# Altium schematic sheet FMC connector.SchDoc: Shuttler
size 420 x 297 mm; Author: G.Kasprowicz; CompanyName: WUT ISE; DrawnBy: G.Kasprowicz; Organization: WUT ISE; Address1: PW ISE; Address2: Nowowiejska 15/19 00-665 Warsaw; Address3: gkasprow@gmail.com; DocumentNumber: 7; SheetNumber: 7; SheetTotal: 10; ModifiedBy: -; CheckedDate: -; Title2: FMC HPC connector; DivGrp: WUT ISE; Designer: G.Kasprowicz; ModifiedDate: -; ProjectName: Sensor Box
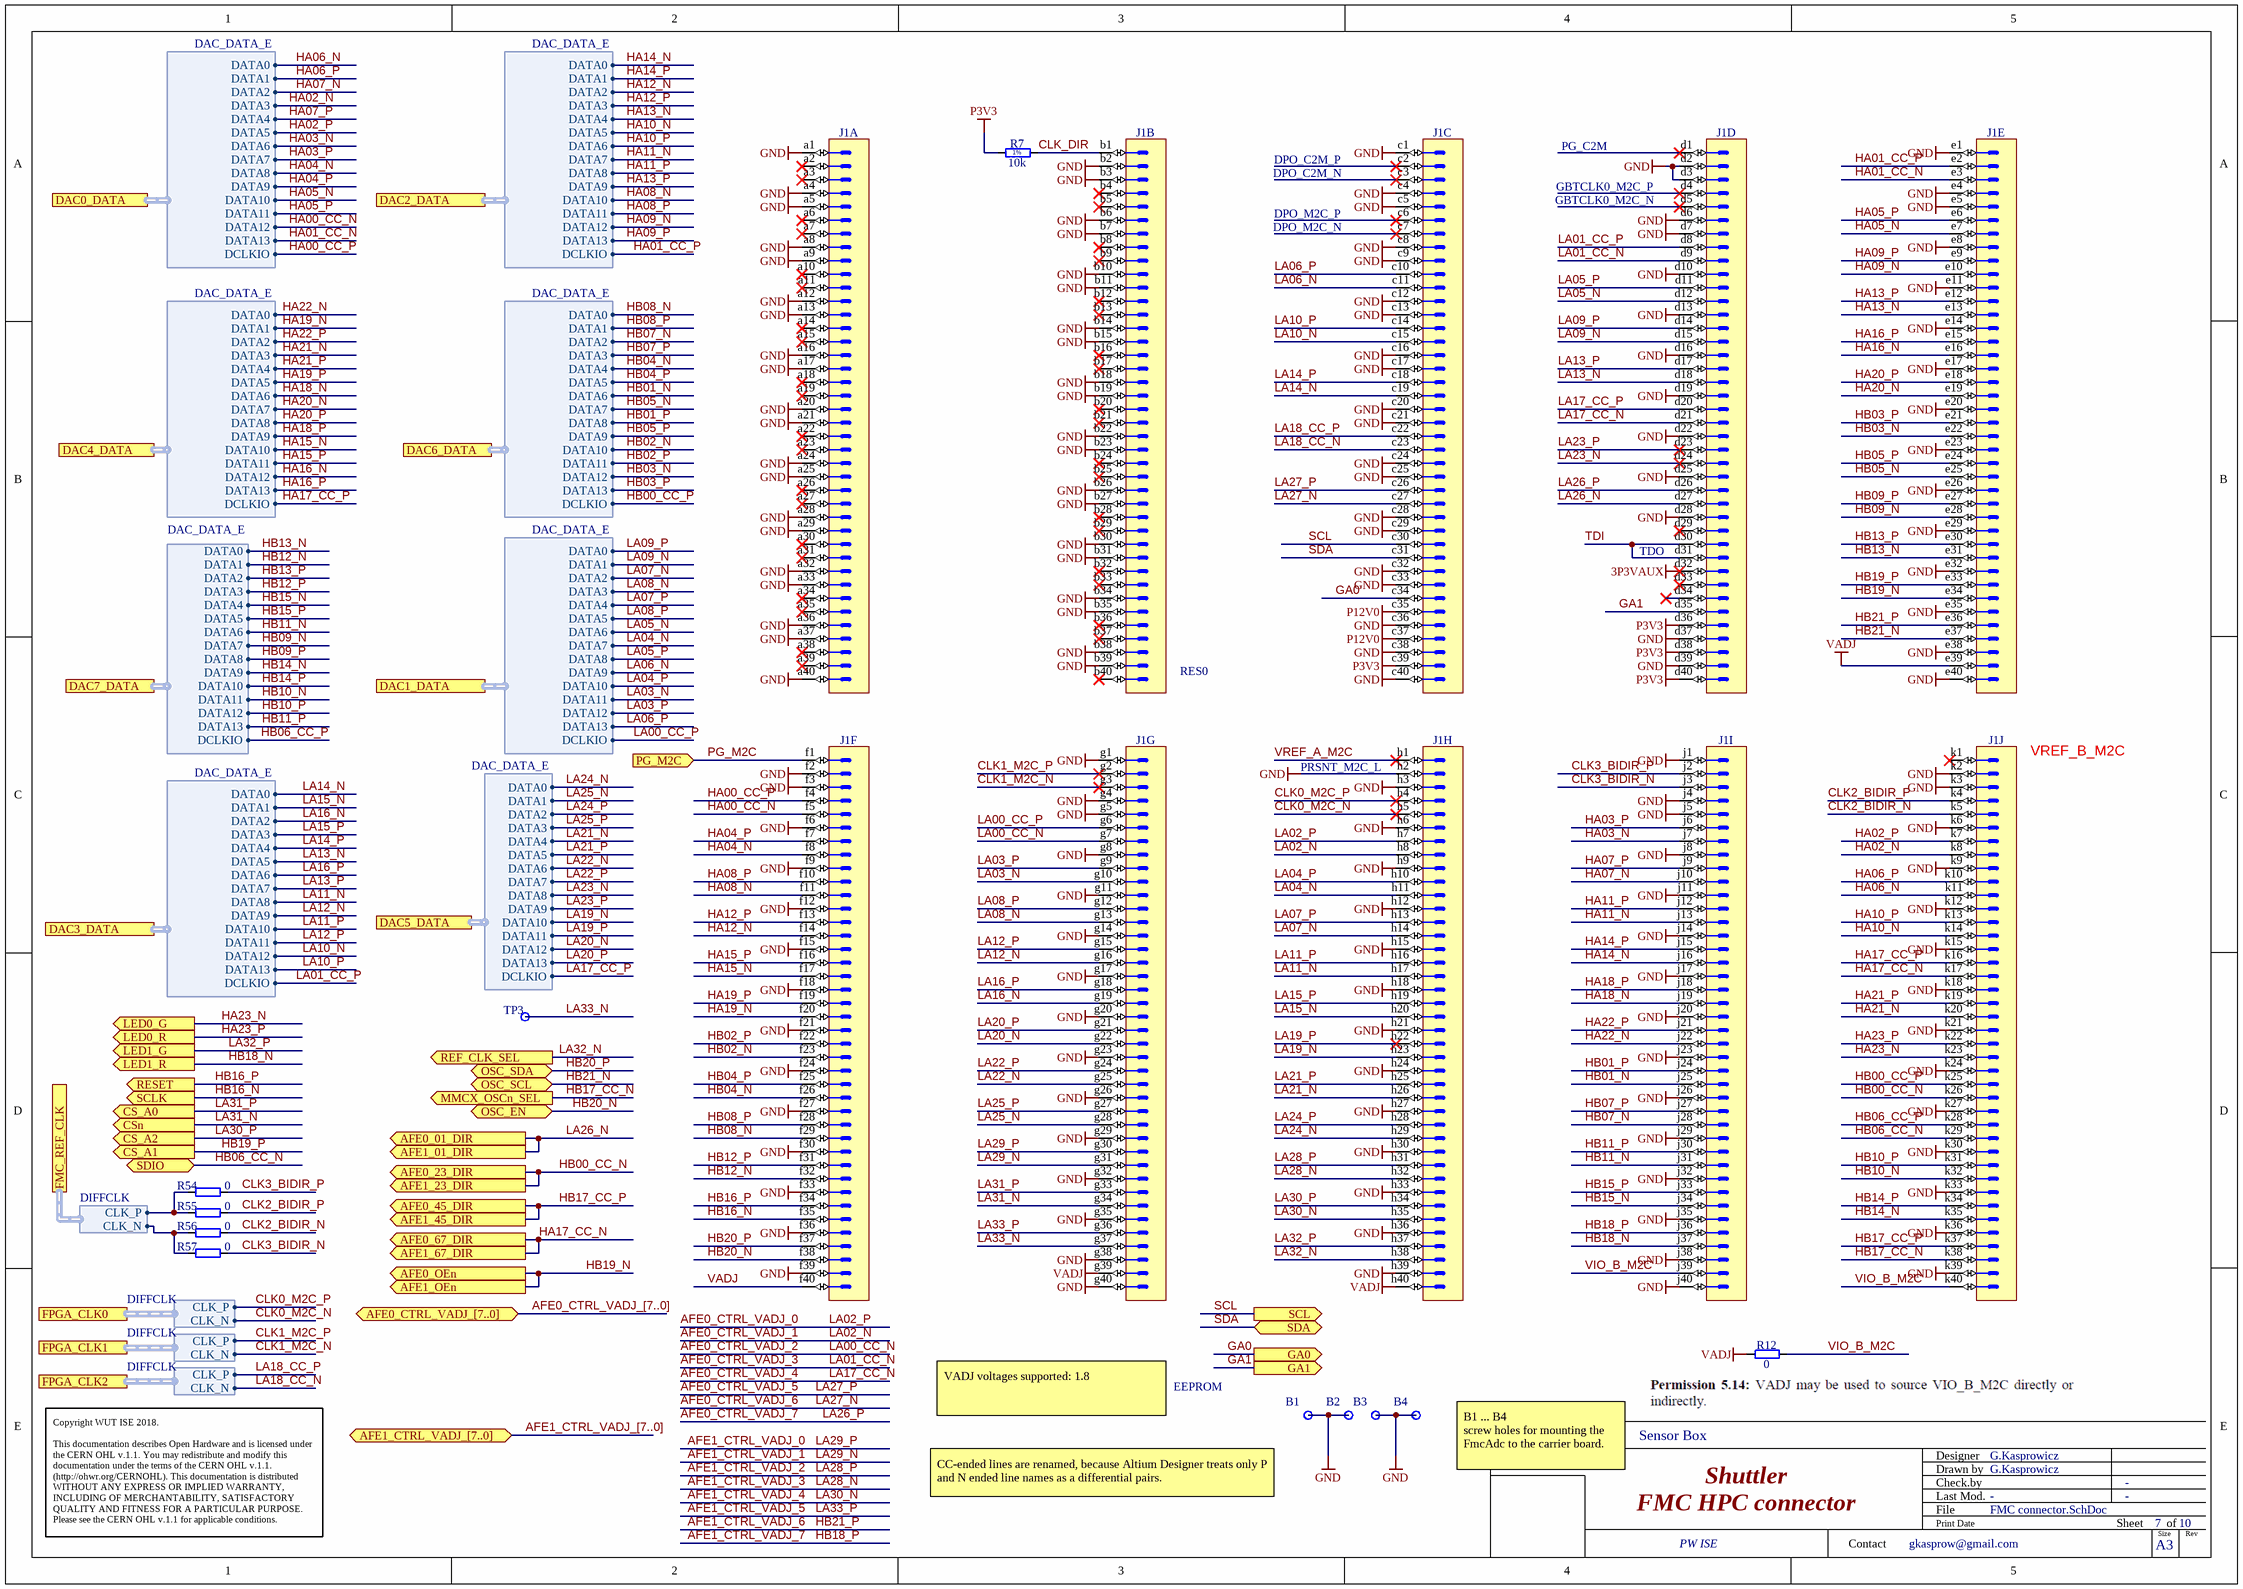
[diagram p0: FMC connector.SchDoc]

## Parts
B1  Plated Hole  [MTG300_600]  (value not drawn)
B2  Plated Hole  [MTG300_600]  (value not drawn)
B3  Plated Hole  [MTG300_600]  (value not drawn)
B4  Plated Hole  [MTG300_600]  (value not drawn)
J1  VITA 57  [SAMTEC_ASP-134488-01]  (value not drawn)  (parts A,B,C,D,E,F,G,H,I,J of 10)
R7  10k  [RESC1005X40N]
R12  0  [RESC1608X55N]
R54  0  [RESC1005X40N]
R55  0  [RESC1005X40N]
R56  0  [RESC1005X40N]
R57  0  [RESC1005X40N]
TP3  Test Point  [TPS127]  (value not drawn)  (no BOM)

## Ports
AFE0_01_DIR (out), AFE0_23_DIR (out), AFE0_45_DIR (out), AFE0_67_DIR (out), AFE0_CTRL_VADJ_[7..0] (bidir), AFE0_OEn (out), AFE1_01_DIR (out), AFE1_23_DIR (out), AFE1_45_DIR (out), AFE1_67_DIR (out), AFE1_CTRL_VADJ_[7..0] (bidir), AFE1_OEn (out), CS_A0 (out), CS_A1 (out), CS_A2 (out), CSn (out), DAC0_DATA (harness DAC_DATA_E), DAC1_DATA (harness DAC_DATA_E), DAC2_DATA (harness DAC_DATA_E), DAC3_DATA (harness DAC_DATA_E), DAC4_DATA (harness DAC_DATA_E), DAC5_DATA (harness DAC_DATA_E), DAC6_DATA (harness DAC_DATA_E), DAC7_DATA (harness DAC_DATA_E), FMC_REF_CLK (harness DIFFCLK), FPGA_CLK0 (harness DIFFCLK), FPGA_CLK1 (harness DIFFCLK), FPGA_CLK2 (harness DIFFCLK), GA0 (out), GA1 (out), LED0_G (out), LED0_R (out), LED1_G (out), LED1_R (out), MMCX_OSCn_SEL (out), OSC_EN (bidir), OSC_SCL (bidir), OSC_SDA (bidir), PG_M2C (in), REF_CLK_SEL (out), RESET (out), SCL (out), SCLK (out), SDA (bidir), SDIO (bidir)

## Harnesses
DAC_DATA_E: DATA0, DATA1, DATA2, DATA3, DATA4, DATA5, DATA6, DATA7, DATA8, DATA9, DATA10, DATA11, DATA12, DATA13, DCLKIO
DIFFCLK: CLK_P, CLK_N

## Nets
3P3VAUX: J1.d32
GND: B1.1 B2.1 B3.1 B4.1 J1.a1 J1.a4 J1.a5 J1.a8 J1.a9 J1.a12 J1.a13 J1.a16 J1.a17 J1.a20 J1.a21 J1.a24 J1.a25 J1.a28 J1.a29 J1.a32 J1.a33 J1.a36 J1.a37 J1.a40 J1.b2 J1.b3 J1.b6 J1.b7 J1.b10 J1.b11 J1.b14 J1.b15 J1.b18 J1.b19 J1.b22 J1.b23 J1.b26 J1.b27 J1.b30 J1.b31 J1.b34 J1.b35 J1.b38 J1.b39 J1.c1 J1.c4 J1.c5 J1.c8 J1.c9 J1.c12 J1.c13 J1.c16 J1.c17 J1.c20 J1.c21 J1.c24 J1.c25 J1.c28 J1.c29 J1.c32 J1.c33 J1.c36 J1.c38 J1.c40 J1.d2 J1.d3 J1.d6 J1.d7 J1.d10 J1.d13 J1.d16 J1.d19 J1.d22 J1.d25 J1.d28 J1.d37 J1.d39 J1.e1 J1.e4 J1.e5 J1.e8 J1.e11 J1.e14 J1.e17 J1.e20 J1.e23 J1.e26 J1.e29 J1.e32 J1.e35 J1.e38 J1.e40 J1.f2 J1.f3 J1.f6 J1.f9 J1.f12 J1.f15 J1.f18 J1.f21 J1.f24 J1.f27 J1.f30 J1.f33 J1.f36 J1.f39 J1.g1 J1.g4 J1.g5 J1.g8 J1.g11 J1.g14 J1.g17 J1.g20 J1.g23 J1.g26 J1.g29 J1.g32 J1.g35 J1.g38 J1.g40 J1.h2 J1.h3 J1.h6 J1.h9 J1.h12 J1.h15 J1.h18 J1.h21 J1.h24 J1.h27 J1.h30 J1.h33 J1.h36 J1.h39 J1.j1 J1.j4 J1.j5 J1.j8 J1.j11 J1.j14 J1.j17 J1.j20 J1.j23 J1.j26 J1.j29 J1.j32 J1.j35 J1.j38 J1.j40 J1.k2 J1.k3 J1.k6 J1.k9 J1.k12 J1.k15 J1.k18 J1.k21 J1.k24 J1.k27 J1.k30 J1.k33 J1.k36 J1.k39
P3V3: J1.c39 J1.d36 J1.d38 J1.d40 R7.1
P12V0: J1.c35 J1.c37
VADJ: J1.e39 J1.f40 J1.g39 J1.h40 R12.1
AFE0_CTRL_VADJ_0: J1.h7  [also labelled LA02_P]
AFE0_CTRL_VADJ_1: J1.h8  [also labelled LA02_N]
AFE0_CTRL_VADJ_2: J1.g7  [also labelled LA00_CC_N]
AFE0_CTRL_VADJ_3: J1.d9  [also labelled LA01_CC_N]
AFE0_CTRL_VADJ_4: J1.d21  [also labelled LA17_CC_N]
AFE0_CTRL_VADJ_5: J1.c26  [also labelled LA27_P]
AFE0_CTRL_VADJ_6: J1.c27  [also labelled LA27_N]
AFE0_CTRL_VADJ_7: J1.d26  [also labelled LA26_P]
AFE1_CTRL_VADJ_0: J1.g30  [also labelled LA29_P]
AFE1_CTRL_VADJ_1: J1.g31  [also labelled LA29_N]
AFE1_CTRL_VADJ_2: J1.h31  [also labelled LA28_P]
AFE1_CTRL_VADJ_3: J1.h32  [also labelled LA28_N]
AFE1_CTRL_VADJ_4: J1.h35  [also labelled LA30_N]
AFE1_CTRL_VADJ_5: J1.g36  [also labelled LA33_P]
AFE1_CTRL_VADJ_6: J1.e36  [also labelled HB21_P]
AFE1_CTRL_VADJ_7: J1.j36  [also labelled HB18_P]
CLK0_M2C_N: J1.h5 ; port FPGA_CLK0.CLK_N
CLK0_M2C_P: J1.h4 ; port FPGA_CLK0.CLK_P
CLK1_M2C_N: J1.g3 ; port FPGA_CLK1.CLK_N
CLK1_M2C_P: J1.g2 ; port FPGA_CLK1.CLK_P
CLK2_BIDIR_N: J1.k5 R56.2
CLK2_BIDIR_P: J1.k4 R55.2
CLK3_BIDIR_N: J1.j3 R57.2
CLK3_BIDIR_P: J1.j2 R54.2
CLK_DIR: J1.b1 R7.2
GA0: J1.c34 ; port GA0
GA1: J1.d35 ; port GA1
HA00_CC_N: J1.f5 ; port DAC0_DATA.DATA12
HA00_CC_P: J1.f4 ; port DAC0_DATA.DCLKIO
HA01_CC_N: J1.e3 ; port DAC0_DATA.DATA13
HA01_CC_P: J1.e2 ; port DAC2_DATA.DCLKIO
HA02_N: J1.k8 ; port DAC0_DATA.DATA3
HA02_P: J1.k7 ; port DAC0_DATA.DATA5
HA03_N: J1.j7 ; port DAC0_DATA.DATA6
HA03_P: J1.j6 ; port DAC0_DATA.DATA7
HA04_N: J1.f8 ; port DAC0_DATA.DATA8
HA04_P: J1.f7 ; port DAC0_DATA.DATA9
HA05_N: J1.e7 ; port DAC0_DATA.DATA10
HA05_P: J1.e6 ; port DAC0_DATA.DATA11
HA06_N: J1.k11 ; port DAC0_DATA.DATA0
HA06_P: J1.k10 ; port DAC0_DATA.DATA1
HA07_N: J1.j10 ; port DAC0_DATA.DATA2
HA07_P: J1.j9 ; port DAC0_DATA.DATA4
HA08_N: J1.f11 ; port DAC2_DATA.DATA10
HA08_P: J1.f10 ; port DAC2_DATA.DATA11
HA09_N: J1.e10 ; port DAC2_DATA.DATA12
HA09_P: J1.e9 ; port DAC2_DATA.DATA13
HA10_N: J1.k14 ; port DAC2_DATA.DATA5
HA10_P: J1.k13 ; port DAC2_DATA.DATA6
HA11_N: J1.j13 ; port DAC2_DATA.DATA7
HA11_P: J1.j12 ; port DAC2_DATA.DATA8
HA12_N: J1.f14 ; port DAC2_DATA.DATA2
HA12_P: J1.f13 ; port DAC2_DATA.DATA3
HA13_N: J1.e13 ; port DAC2_DATA.DATA4
HA13_P: J1.e12 ; port DAC2_DATA.DATA9
HA14_N: J1.j16 ; port DAC2_DATA.DATA0
HA14_P: J1.j15 ; port DAC2_DATA.DATA1
HA15_N: J1.f17 ; port DAC4_DATA.DATA10
HA15_P: J1.f16 ; port DAC4_DATA.DATA11
HA16_N: J1.e16 ; port DAC4_DATA.DATA12
HA16_P: J1.e15 ; port DAC4_DATA.DATA13
HA17_CC_N: J1.k17 ; port AFE0_67_DIR, port AFE1_67_DIR
HA17_CC_P: J1.k16 ; port DAC4_DATA.DCLKIO
HA18_N: J1.j19 ; port DAC4_DATA.DATA6
HA18_P: J1.j18 ; port DAC4_DATA.DATA9
HA19_N: J1.f20 ; port DAC4_DATA.DATA1
HA19_P: J1.f19 ; port DAC4_DATA.DATA5
HA20_N: J1.e19 ; port DAC4_DATA.DATA7
HA20_P: J1.e18 ; port DAC4_DATA.DATA8
HA21_N: J1.k20 ; port DAC4_DATA.DATA3
HA21_P: J1.k19 ; port DAC4_DATA.DATA4
HA22_N: J1.j22 ; port DAC4_DATA.DATA0
HA22_P: J1.j21 ; port DAC4_DATA.DATA2
HA23_N: J1.k23 ; port LED0_G
HA23_P: J1.k22 ; port LED0_R
HB00_CC_N: J1.k26 ; port AFE0_23_DIR, port AFE1_23_DIR
HB00_CC_P: J1.k25 ; port DAC6_DATA.DCLKIO
HB01_N: J1.j25 ; port DAC6_DATA.DATA6
HB01_P: J1.j24 ; port DAC6_DATA.DATA8
HB02_N: J1.f23 ; port DAC6_DATA.DATA10
HB02_P: J1.f22 ; port DAC6_DATA.DATA11
HB03_N: J1.e22 ; port DAC6_DATA.DATA12
HB03_P: J1.e21 ; port DAC6_DATA.DATA13
HB04_N: J1.f26 ; port DAC6_DATA.DATA4
HB04_P: J1.f25 ; port DAC6_DATA.DATA5
HB05_N: J1.e25 ; port DAC6_DATA.DATA7
HB05_P: J1.e24 ; port DAC6_DATA.DATA9
HB06_CC_N: J1.k29 ; port SDIO
HB06_CC_P: J1.k28 ; port DAC7_DATA.DCLKIO
HB07_N: J1.j28 ; port DAC6_DATA.DATA2
HB07_P: J1.j27 ; port DAC6_DATA.DATA3
HB08_N: J1.f29 ; port DAC6_DATA.DATA0
HB08_P: J1.f28 ; port DAC6_DATA.DATA1
HB09_N: J1.e28 ; port DAC7_DATA.DATA7
HB09_P: J1.e27 ; port DAC7_DATA.DATA8
HB10_N: J1.k32 ; port DAC7_DATA.DATA11
HB10_P: J1.k31 ; port DAC7_DATA.DATA12
HB11_N: J1.j31 ; port DAC7_DATA.DATA6
HB11_P: J1.j30 ; port DAC7_DATA.DATA13
HB12_N: J1.f32 ; port DAC7_DATA.DATA1
HB12_P: J1.f31 ; port DAC7_DATA.DATA3
HB13_N: J1.e31 ; port DAC7_DATA.DATA0
HB13_P: J1.e30 ; port DAC7_DATA.DATA2
HB14_N: J1.k35 ; port DAC7_DATA.DATA9
HB14_P: J1.k34 ; port DAC7_DATA.DATA10
HB15_N: J1.j34 ; port DAC7_DATA.DATA4
HB15_P: J1.j33 ; port DAC7_DATA.DATA5
HB16_N: J1.f35 ; port SCLK
HB16_P: J1.f34 ; port RESET
HB17_CC_N: J1.k38 ; port MMCX_OSCn_SEL
HB17_CC_P: J1.k37 ; port AFE1_45_DIR, port AFE0_45_DIR
HB18_N: J1.j37 ; port LED1_R
HB19_N: J1.e34 ; port AFE1_OEn, port AFE0_OEn
HB19_P: J1.e33 ; port CS_A1
HB20_N: J1.f38 ; port OSC_EN
HB20_P: J1.f37 ; port OSC_SDA
HB21_N: J1.e37 ; port OSC_SCL
LA00_CC_P: J1.g6 ; port DAC1_DATA.DCLKIO
LA01_CC_P: J1.d8 ; port DAC3_DATA.DCLKIO
LA03_N: J1.g10 ; port DAC1_DATA.DATA11
LA03_P: J1.g9 ; port DAC1_DATA.DATA12
LA04_N: J1.h11 ; port DAC1_DATA.DATA7
LA04_P: J1.h10 ; port DAC1_DATA.DATA10
LA05_N: J1.d12 ; port DAC1_DATA.DATA6
LA05_P: J1.d11 ; port DAC1_DATA.DATA8
LA06_N: J1.c11 ; port DAC1_DATA.DATA9
LA06_P: J1.c10 ; port DAC1_DATA.DATA13
LA07_N: J1.h14 ; port DAC1_DATA.DATA2
LA07_P: J1.h13 ; port DAC1_DATA.DATA4
LA08_N: J1.g13 ; port DAC1_DATA.DATA3
LA08_P: J1.g12 ; port DAC1_DATA.DATA5
LA09_N: J1.d15 ; port DAC1_DATA.DATA1
LA09_P: J1.d14 ; port DAC1_DATA.DATA0
LA10_N: J1.c15 ; port DAC3_DATA.DATA12
LA10_P: J1.c14 ; port DAC3_DATA.DATA13
LA11_N: J1.h17 ; port DAC3_DATA.DATA8
LA11_P: J1.h16 ; port DAC3_DATA.DATA10
LA12_N: J1.g16 ; port DAC3_DATA.DATA9
LA12_P: J1.g15 ; port DAC3_DATA.DATA11
LA13_N: J1.d18 ; port DAC3_DATA.DATA5
LA13_P: J1.d17 ; port DAC3_DATA.DATA7
LA14_N: J1.c19 ; port DAC3_DATA.DATA0
LA14_P: J1.c18 ; port DAC3_DATA.DATA4
LA15_N: J1.h20 ; port DAC3_DATA.DATA1
LA15_P: J1.h19 ; port DAC3_DATA.DATA3
LA16_N: J1.g19 ; port DAC3_DATA.DATA2
LA16_P: J1.g18 ; port DAC3_DATA.DATA6
LA17_CC_P: J1.d20 ; port DAC5_DATA.DCLKIO
LA18_CC_N: J1.c23 ; port FPGA_CLK2.CLK_N
LA18_CC_P: J1.c22 ; port FPGA_CLK2.CLK_P
LA19_N: J1.h23 ; port DAC5_DATA.DATA10
LA19_P: J1.h22 ; port DAC5_DATA.DATA11
LA20_N: J1.g22 ; port DAC5_DATA.DATA12
LA20_P: J1.g21 ; port DAC5_DATA.DATA13
LA21_N: J1.h26 ; port DAC5_DATA.DATA4
LA21_P: J1.h25 ; port DAC5_DATA.DATA5
LA22_N: J1.g25 ; port DAC5_DATA.DATA6
LA22_P: J1.g24 ; port DAC5_DATA.DATA7
LA23_N: J1.d24 ; port DAC5_DATA.DATA8
LA23_P: J1.d23 ; port DAC5_DATA.DATA9
LA24_N: J1.h29 ; port DAC5_DATA.DATA0
LA24_P: J1.h28 ; port DAC5_DATA.DATA2
LA25_N: J1.g28 ; port DAC5_DATA.DATA1
LA25_P: J1.g27 ; port DAC5_DATA.DATA3
LA26_N: J1.d27 ; port AFE1_01_DIR, port AFE0_01_DIR
LA30_P: J1.h34 ; port CS_A2
LA31_N: J1.g34 ; port CSn
LA31_P: J1.g33 ; port CS_A0
LA32_N: J1.h38 ; port REF_CLK_SEL
LA32_P: J1.h37 ; port LED1_G
LA33_N: J1.g37 TP3.1
PG_M2C: J1.f1 ; port PG_M2C
SCL: J1.c30 ; port SCL
SDA: J1.c31 ; port SDA
TDI: J1.d30 J1.d31
VIO_B_M2C: J1.j39 J1.k40 R12.2
VREF_A_M2C: J1.h1
NetR54_1: R54.1 R55.1 ; port FMC_REF_CLK.CLK_P
NetR56_1: R56.1 R57.1 ; port FMC_REF_CLK.CLK_N

Not connected (* = marked no-connect by the designer): J1 a2* a3* a6* a7* a10* a11* a14* a15* a18* a19* a22* a23* a26* a27* a30* a31* a34* a35* a38* a39* b4* b5* b8* b9* b12* b13* b16* b17* b20* b21* b24* b25* b28* b29* b32* b33* b36* b37* b40* c2* c3* c6* c7* d1* d4* d5* d29* d33* d34* k1*

## Buses and harness runs
bus AFE0_CTRL_VADJ_[7..0] = port AFE0_CTRL_VADJ_[7..0]
bus AFE1_CTRL_VADJ_[7..0] = port AFE1_CTRL_VADJ_[7..0]

## Notes on the sheet
- DPO_C2M_P
- DPO_C2M_N
- PG_C2M
- GBTCLK0_M2C_P
- DPO_M2C_P
- DPO_M2C_N
- GBTCLK0_M2C_N
- (near J1) TDO
- RES0
- (near J1) PRSNT_M2C_L
- VREF_B_M2C
- EEPROM
- VADJ voltages supported: 1.8
- (near B4) B1 ... B4
  screw holes for mounting the FmcAdc to the carrier board.
- (near B1) CC-ended lines are renamed, because Altium Designer treats only P and N ended line names as a differential pairs.
- Project/Equipment
- Document
- Designer
- Drawn by
- Check.by
- Copyright WUT ISE 2018.
  This documentation describes Open Hardware and is licensed under the CERN OHL v.1.1. You may redistribute and modify this documentation under the terms of the CERN OHL v.1.1. (http://ohwr.org/CERNOHL). This documentation is distributed WITHOUT ANY EXPRESS OR IMPLIED WARRANTY, INCLUDING OF MERCHANTABILITY, SATISFACTORY QUALITY AND FITNESS FOR A PARTICULAR PURPOSE. Please see the CERN OHL v.1.1 for applicable conditions.
- Contact
- File
- Last Mod.
- Print Date
- Sheet
- Size
- A3
- of
- Rev
- (in symbol R0402_10K_1%_0.0625W_100PPM) 1%

## Library data of the parts
B1-B4 = PLATED_HOLE3.0_PAD6.0: Single Terminal Socket; Part Description: Plated Through Hole: Hole Dia.=3.0mm Pad Dia.=6.0mm; Mounted: No; Table: Pads; Part Number: PLATED_HOLE3.0_PAD6.0; Component Kind: Standard (No BOM); Component Type: Standard (No BOM); Designator: Single Terminal Socket; Library Reference: Single Terminal Socket; Pin Count: 1; Family: Plated Hole; Socket: No; SMD: No; Status: None; ComponentHeight: 0mm; Author: CERN DEM JLC; CreateDate: 26.05.2008; LatestRevisionDate: 26.05.2008; PackageDescription: Plated Through Hole: Hole Dia.=3.0mm Pad Dia.=6.0mm
J1 = SAMTEC_ASP-134488-01: Connector VITA 57, 400 Male contacts in 10 row abcdefghj; Part Description: 400 contacts (10 rows abcdefghj) Surface Mount Male Connector, VITA 57 (MC-HPC-10); Manufacturer: SAMTEC; Part Number: SAMTEC_ASP-134488-01; Component Kind: Standard; Component Type: Standard; Pin Count: 400; Family: VITA 57; Mounted: Yes; Socket: No; SMD: Yes; Status: None; Manufacturer Part Number: ASP-134488-01; ComponentHeight: 6.1mm; HelpURL: \\cern.ch\dfs\Applications\Altium\Datasheets\SAMTEC_ASP-134488-01.pdf; Author: CERN DEM JLC; CreateDate: 30/04/2009; LatestRevisionDate: 17/08/2009; Table: SAMTEC
R7 = R0402_10K_1%_0.0625W_100PPM: Resistor - 1%; Part Description: General Purpose Thick Film Chip Resistor; Manufacturer: GENERIC; Manufacturer1 Part Number: 232270671003L; TC: ±100ppm/°C; Table: Resistors SMD; Part Number: R0402_10K_1%_0.0625W_100PPM; Component Kind: Standard; Component Type: Standard; Pin Count: 2; Value: 10k; Status: Not recommended; Power: 0.0625W; Tolerance: ±1%; Manufacturer Part Number: R0402_10K_1%_0.0625W_100PPM; Case: 0402; Mounted: Yes; Socket: No; SMD: Yes; Manufacturer1 Example: YAGEO PHYCOMP; Manufacturer1 ComponentHeight: 0.4mm; HelpURL: \\cern.ch\dfs\Applications\Altium\Datasheets\R0402_Phycomp_RC0402.pdf; Author: CERN DEM JLC; CreateDate: 2007-12-03; LatestRevisionDate: 2012-10-17
R12 = R0603_0R_JUMPER: Resistor; Part Description: 1A (0.05R Max DC Resistance) Zero Ohm Jumper; Manufacturer: GENERIC; Manufacturer1 Part Number: NRC06Z0; PressFit: No; Part Number: R0603_0R_JUMPER; Component Kind: Standard; Component Type: Standard; Pin Count: 2; Value: 0; Status: Preferred; Manufacturer Part Number: R0603_0R_JUMPER; Case: 0603; Mounted: Yes; Sense: No; Socket: No; SMD: Yes; Manufacturer1 Example: NIC COMPONENT; Manufacturer1 ComponentHeight: 0.55mm; HelpURL: \\cern.ch\dfs\Applications\Altium\Datasheets\R0603_NIC_NRC.pdf; Author: CERN DEM JLC; CreateDate: 03.12.2007; LatestRevisionDate: 13.03.2008
R54-R57 = R0402_0R_JUMPER: Resistor; Part Description: 1A (0.05R Max DC Resistance) Zero Ohm Jumper; Manufacturer: GENERIC; Manufacturer1 Part Number: 232270591001L; PressFit: No; Part Number: R0402_0R_JUMPER; Component Kind: Standard; Component Type: Standard; Pin Count: 2; Value: 0; Status: Not Recommended; Manufacturer Part Number: R0402_0R_JUMPER; Case: 0402; Mounted: Yes; Sense: No; Socket: No; SMD: Yes; Manufacturer1 Example: YAGEO PHYCOMP; Manufacturer1 ComponentHeight: 0.4mm; HelpURL: \\cern.ch\dfs\Applications\Altium\Datasheets\R0402_Phycomp_RC0402.pdf; Author: CERN DEM JLC; CreateDate: 03/12/2007; LatestRevisionDate: 17/10/2012
TP3 = SMD_PAD_1.27X1.27MM: Part Description: 1.27mm x 1.27mm PCB Copper Area (SMD Test Point); Mounted: No; Part Number: SMD_PAD_1.27X1.27MM; Component Type: Standard (No BOM); Pin Count: 1; Family: Test Point; Socket: No; SMD: Yes; Sense: No; Status: None; ComponentHeight: 0mm; HelpURL: Undefined; Author: CERN DEM JLC; CreateDate: 12.01.2008; LatestRevisionDate: 12.01.2008; PackageDescription: 1.27mm x 1.27mm PCB Copper Area (SMD Test Point)